# Altium schematic sheet energy_router_panel_#1.SchDoc
size A4
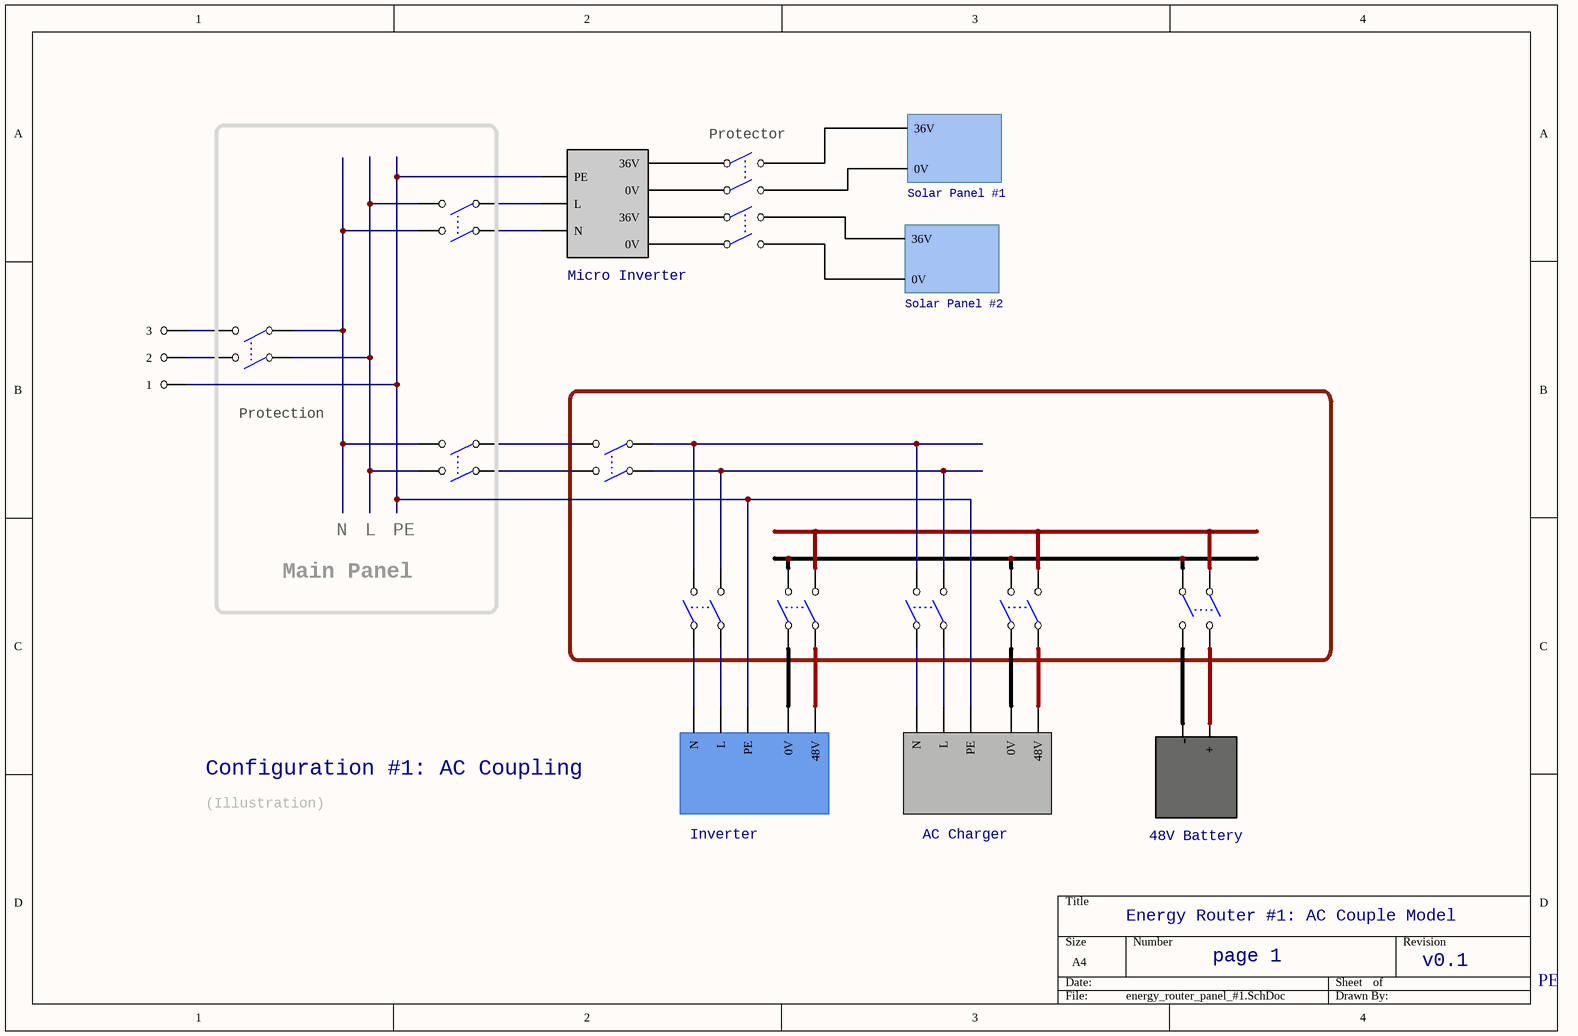
[diagram p0: energy_router_panel_#1.SchDoc]

## Parts
Battery_?  48V Battery
JP01  3 HEADER  (value not drawn)
K2  Switch  (value not drawn)
K4  Switch  (value not drawn)
K5  Switch  (value not drawn)
K10  Switch  (value not drawn)
K11  Switch  (value not drawn)
K13  Switch  (value not drawn)
K14  Switch  (value not drawn)
K15  Switch  (value not drawn)
K16  Switch  (value not drawn)
K17  Switch  (value not drawn)
K18  Switch  (value not drawn)
U1  Micro Inverter
U4  Solar Panel #1
U5  Solar Panel #2
U11  Inverter
U12  AC Charger

## Blocks framed on the sheet
Main Panel: K2 K10 K11

## Nets
NetBattery_?_1: Battery_?.1(-) K18.4
NetBattery_?_2: Battery_?.2(+) K18.2
NetJP01_1: JP01.1 U1.3(PE) U11.3(PE) U12.3(PE)
NetJP01_2: JP01.2 K10.2
NetJP01_3: JP01.3 K10.4
NetK2_1: K2.1 K13.2
NetK2_2: K2.2 K10.1 K11.4
NetK2_3: K2.3 K13.4
NetK2_4: K2.4 K10.3 K11.2
NetK4_1: K4.1 U1.7(36V)
NetK4_2: K4.2 U4.2(36V)
NetK4_3: K4.3 U1.6(0V)
NetK4_4: K4.4 U4.1(0V)
NetK5_1: K5.1 U1.5(36V)
NetK5_2: K5.2 U5.2(36V)
NetK5_3: K5.3 U1.4(0V)
NetK5_4: K5.4 U5.1(0V)
NetK11_1: K11.1 U1.1(N)
NetK11_3: K11.3 U1.2(L)
NetK13_1: K13.1 K14.4 K16.4
NetK13_3: K13.3 K14.2 K16.2
NetK14_1: K14.1 U11.1(N)
NetK14_3: K14.3 U11.2(L)
NetK15_1: K15.1 U11.4(0V)
NetK15_2: K15.2 K17.2 K18.3
NetK15_3: K15.3 U11.5(48V)
NetK15_4: K15.4 K17.4 K18.1
NetK16_1: K16.1 U12.1(N)
NetK16_3: K16.3 U12.2(L)
NetK17_1: K17.1 U12.4(0V)
NetK17_3: K17.3 U12.5(48V)

## Notes on the sheet
- (near K4) Protector
- (near K10) Protection
- N
- L
- PE
- Configuration #1: AC Coupling
- (Illustration)
- Energy Router #1: AC Couple Model
- page 1
- v0.1

## Library data of the parts
Battery_? = 1_BAT_48V
JP01 = 3 HEADER: 3 Pin Header
K2 K4 K5 K10 K11 K13-K18 = SW-DPST
U1 = 11_Micro_Inverter_2
U4 U5 = 10_Solar_Panel_36V
U11 = 4_Inverter_Panel
U12 = 5_Charger_48V_Panel